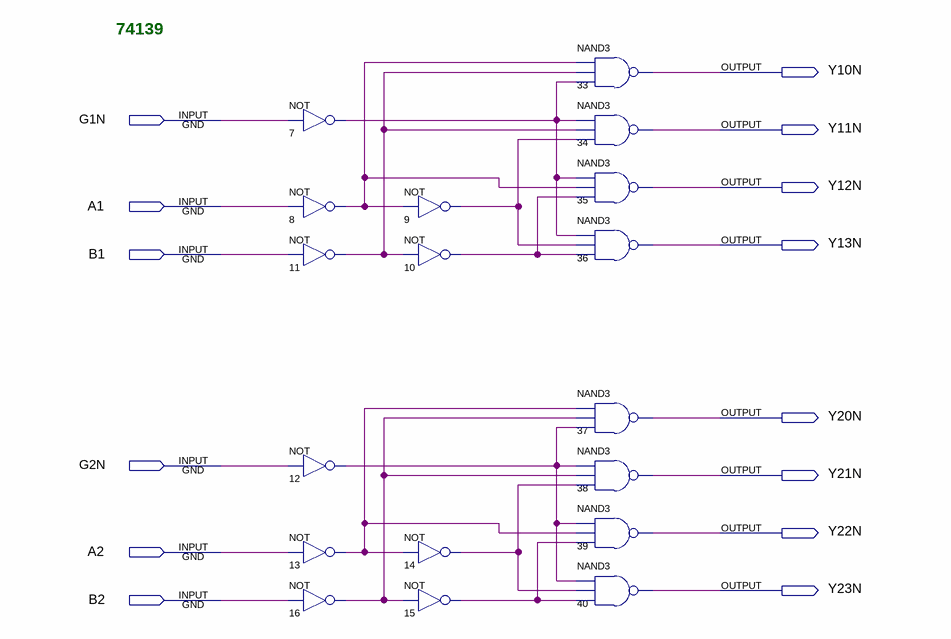
[diagram p0: schematic sheet]
// Quartus schematic 74139.bdf as structural Verilog: 18 symbols, 14 pins
module \74139  (
  input  G1N,
  input  A1,
  input  B1,
  input  G2N,
  input  A2,
  input  B2,
  output Y10N,
  output Y11N,
  output Y12N,
  output Y13N,
  output Y20N,
  output Y21N,
  output Y22N,
  output Y23N
);

  wire n7_out, n8_out, n9_out, n10_out, n11_out, n12_out, n13_out, n14_out, n15_out, n16_out;

  not u_7 (n7_out, G1N);
  not u_8 (n8_out, A1);
  not u_11 (n11_out, B1);
  not u_12 (n12_out, G2N);
  not u_13 (n13_out, A2);
  not u_16 (n16_out, B2);
  not u_9 (n9_out, n8_out);
  not u_10 (n10_out, n11_out);
  not u_14 (n14_out, n13_out);
  not u_15 (n15_out, n16_out);
  nand u_33 (Y10N, n8_out, n11_out, n7_out);
  nand u_34 (Y11N, n7_out, n11_out, n9_out);
  nand u_35 (Y12N, n7_out, n8_out, n10_out);
  nand u_36 (Y13N, n7_out, n9_out, n10_out);
  nand u_37 (Y20N, n13_out, n16_out, n12_out);
  nand u_38 (Y21N, n12_out, n16_out, n14_out);
  nand u_39 (Y22N, n12_out, n13_out, n15_out);
  nand u_40 (Y23N, n12_out, n14_out, n15_out);

  // Notes on the sheet:
  //   74139
endmodule
